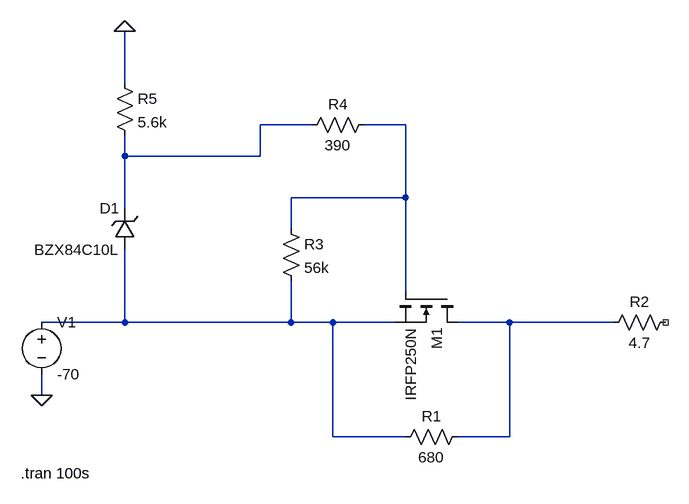
[diagram p0: schematic ChargeCapacitor-.asc]
ChargeCapacitor-.asc, the LTspice schematic file:
Version 4
SHEET 1 880 680
WIRE -256 -176 -256 -256
WIRE 32 -112 -48 -112
WIRE 176 -112 112 -112
WIRE -256 -64 -256 -96
WIRE -48 -64 -48 -112
WIRE -48 -64 -256 -64
WIRE 176 0 176 -112
WIRE 176 0 0 0
WIRE -256 16 -256 -64
WIRE 0 48 0 0
WIRE 176 144 176 0
WIRE -256 192 -256 80
WIRE -256 192 -384 192
WIRE 0 192 0 128
WIRE 0 192 -256 192
WIRE 64 192 0 192
WIRE 160 192 64 192
WIRE 336 192 256 192
WIRE 496 192 336 192
WIRE -384 304 -384 272
WIRE 64 368 64 192
WIRE 176 368 64 368
WIRE 336 368 336 192
WIRE 336 368 256 368
FLAG -384 304 0
FLAG -256 -256 0
DATAFLAG 112 368 ""
DATAFLAG 176 48 ""
DATAFLAG -192 192 ""
DATAFLAG -256 -16 ""
SYMBOL nmos 256 144 R90
SYMATTR InstName M1
SYMATTR Value IRFP250N
SYMBOL res 272 352 R90
WINDOW 0 0 56 VBottom 2
WINDOW 3 32 56 VTop 2
SYMATTR InstName R1
SYMATTR Value 680
SYMBOL res 592 176 R90
WINDOW 0 0 56 VBottom 2
WINDOW 3 32 56 VTop 2
SYMATTR InstName R2
SYMATTR Value 4.7
SYMBOL voltage -384 176 R0
WINDOW 123 0 0 Left 0
WINDOW 39 0 0 Left 0
SYMATTR InstName V1
SYMATTR Value -70
SYMBOL res -16 32 R0
SYMATTR InstName R3
SYMATTR Value 56k
SYMBOL res 128 -128 R90
WINDOW 0 0 56 VBottom 2
WINDOW 3 32 56 VTop 2
SYMATTR InstName R4
SYMATTR Value 390
SYMBOL zener -240 80 R180
WINDOW 0 24 64 Left 2
WINDOW 3 24 0 Left 2
SYMATTR InstName D1
SYMATTR Value BZX84C10L
SYMATTR Description Diode
SYMATTR Type diode
SYMBOL res -272 -192 R0
SYMATTR InstName R5
SYMATTR Value 5.6k
TEXT -416 424 Left 2 !.tran 100s

The netlist it stands for:
* ChargeCapacitor-.asc
M1 N004 N002 N003 N003 IRFP250N
R1 N004 N003 680
R2 NC_01 N004 4.7
V1 N003 0 -70
R3 N002 N003 56k
R4 N002 N001 390
D1 N003 N001 BZX84C10L
R5 0 N001 5.6k
.model D D
.lib standard.dio
.model NMOS NMOS
.model PMOS PMOS
.lib standard.mos
.tran 100s
.backanno
.end